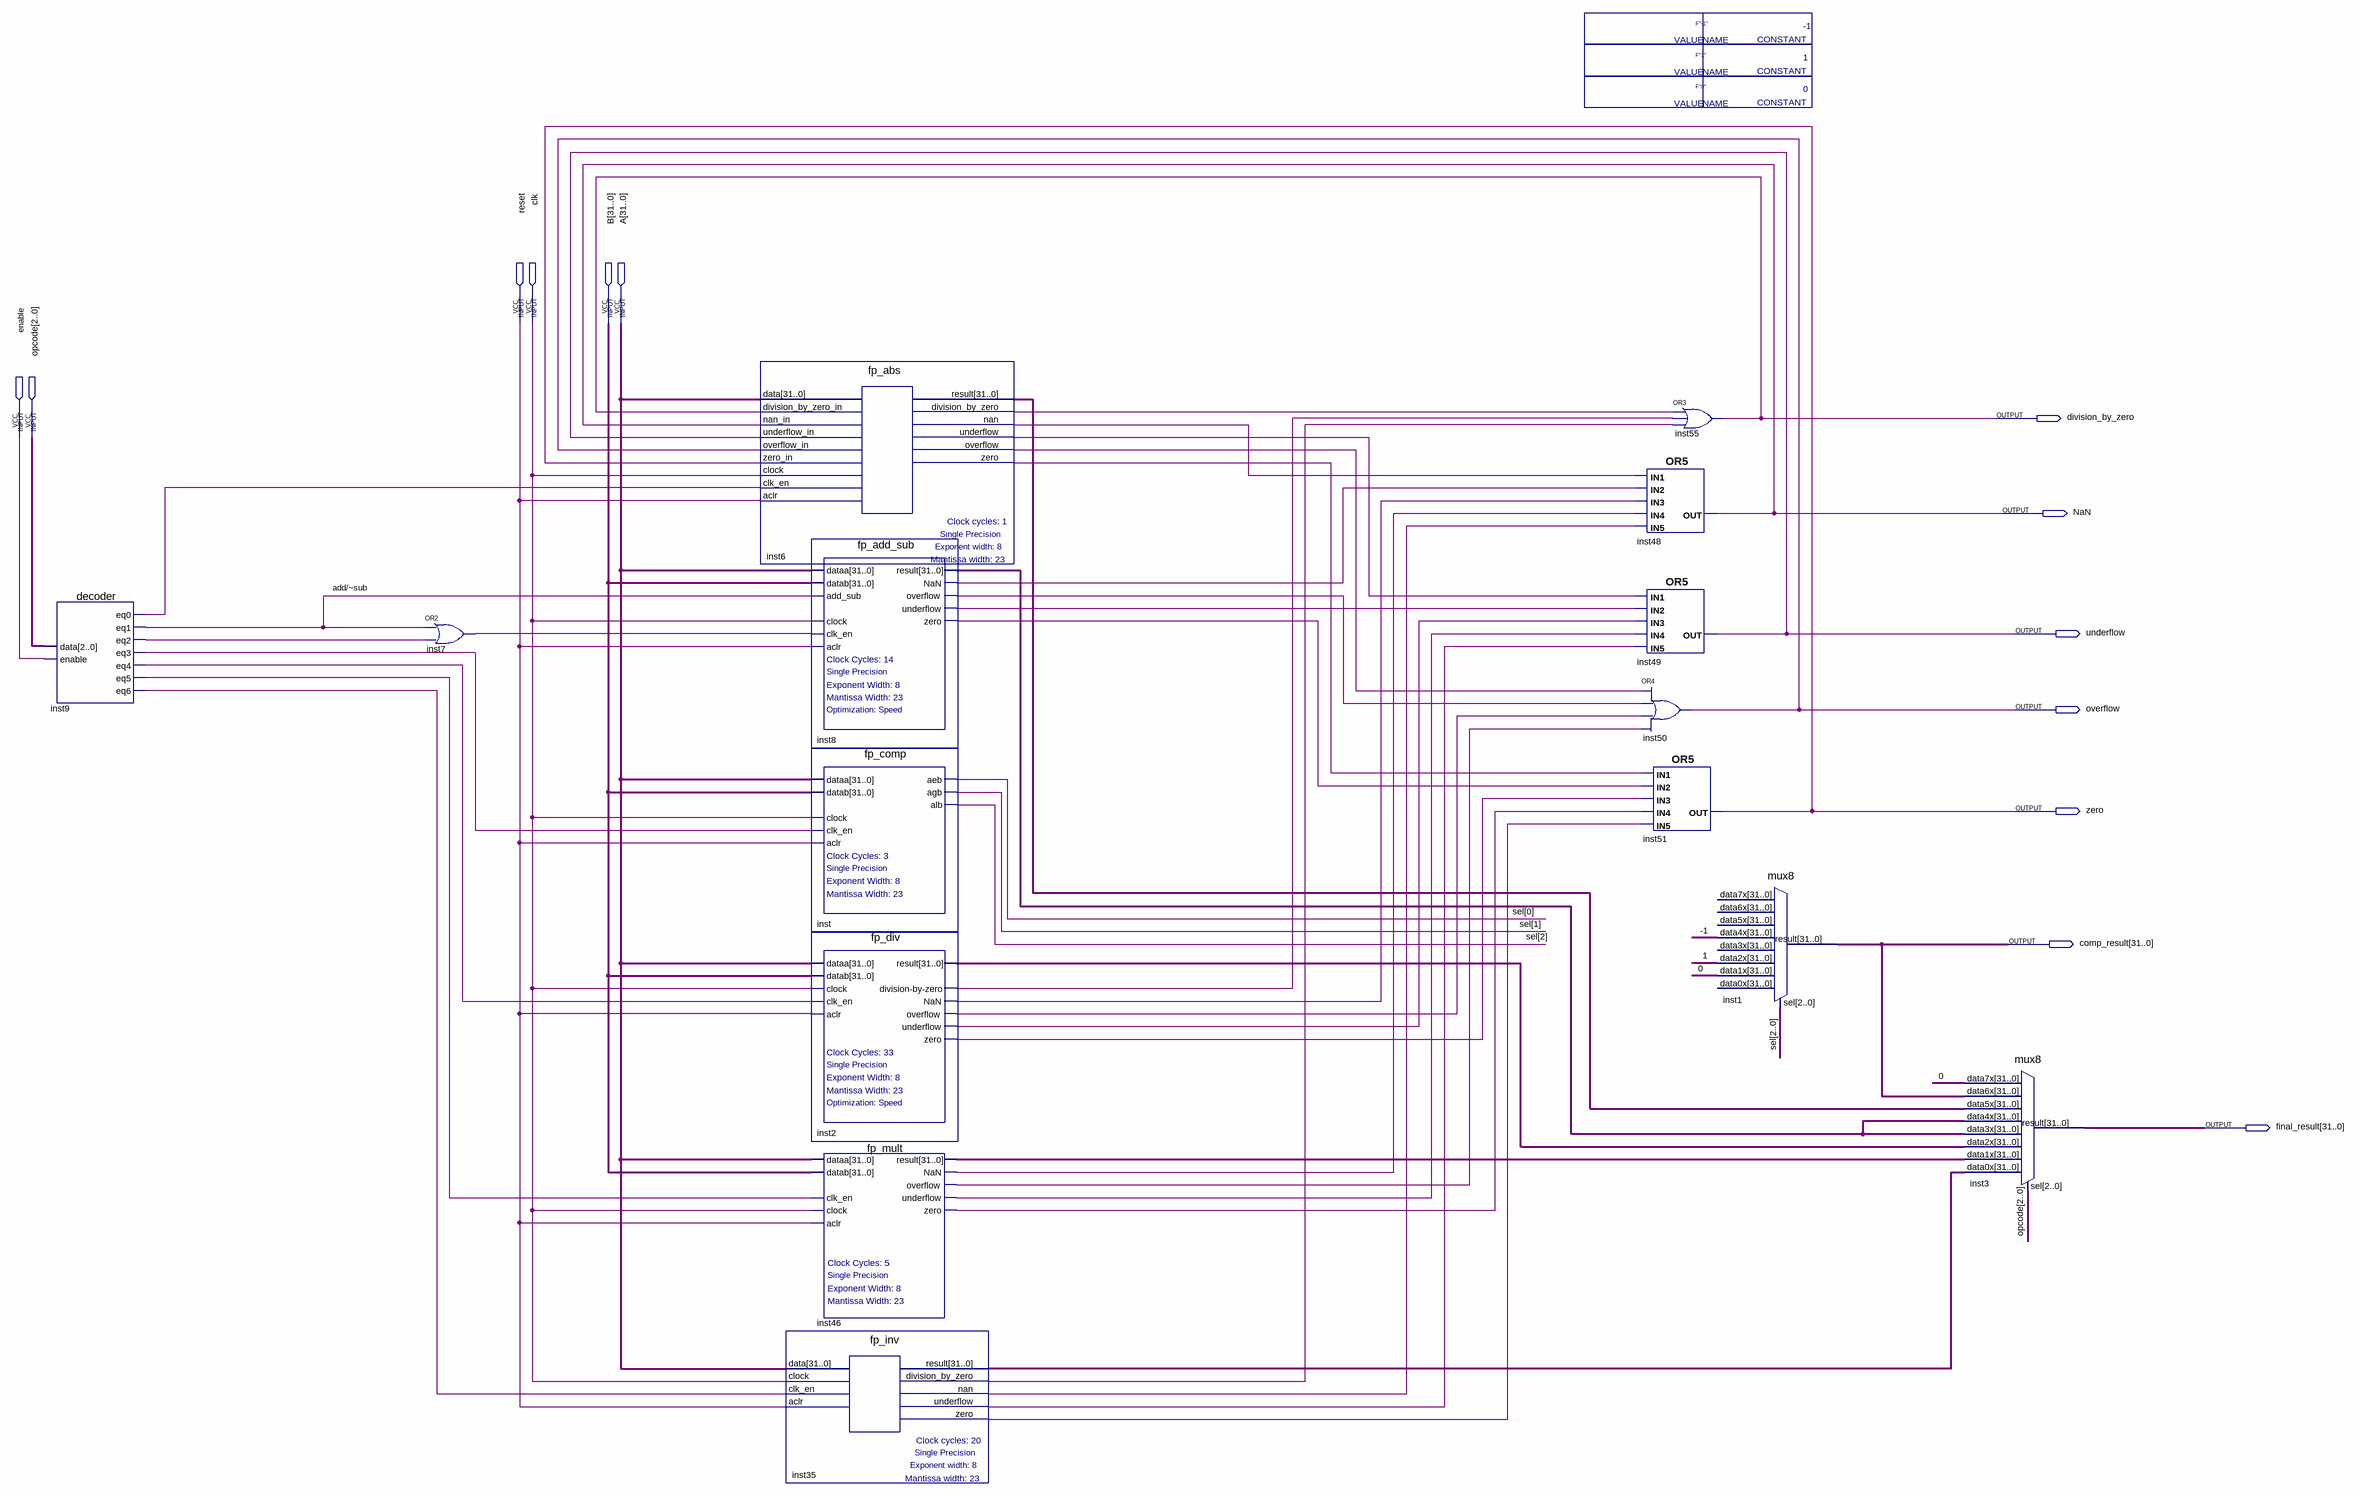
[diagram p0: schematic sheet]
// Quartus schematic fp_alu.bdf as structural Verilog: 15 symbols, 13 pins
module fp_alu #(parameter \1  = "F\"1\"", parameter \0  = "F\"0\"", parameter \-1  = "F\"-1\"") (
  input  reset,
  input  clk,
  input  [31:0] B,
  input  [31:0] A,
  input  enable,
  input  [2:0] opcode,
  output division_by_zero,
  output NaN,
  output underflow,
  output overflow,
  output zero,
  output [31:0] comp_result,
  output [31:0] final_result
);

  wire \0 , \1 , \-1 , \add/~sub , inst2_division_by_zero, inst2_nan, inst2_overflow, inst2_underflow,
       inst2_zero, inst6_division_by_zero, inst6_nan, inst6_overflow, inst6_underflow, inst6_zero, inst7_out,
       inst8_nan, inst8_overflow, inst8_underflow, inst8_zero, inst9_eq0, inst9_eq2, inst9_eq3, inst9_eq4,
       inst9_eq5, inst9_eq6, inst35_division_by_zero, inst35_nan, inst35_underflow, inst35_zero, inst46_nan,
       inst46_overflow, inst46_underflow, inst46_zero;
  wire [2:0] sel;
  wire [31:0] inst2_result, inst6_result, inst8_result, inst35_result, inst46_result;

  decoder inst9 (
    .data(opcode), .enable(enable), .eq0(inst9_eq0), .eq1(\add/~sub ), .eq2(inst9_eq2), .eq3(inst9_eq3),
    .eq4(inst9_eq4), .eq5(inst9_eq5), .eq6(inst9_eq6));
  or inst7 (inst7_out, \add/~sub , inst9_eq2);
  fp_abs inst6 (
    .data(A), .division_by_zero_in(division_by_zero), .nan_in(NaN), .underflow_in(underflow),
    .overflow_in(overflow), .zero_in(zero), .clock(clk), .clk_en(inst9_eq0), .aclr(reset),
    .result(inst6_result), .division_by_zero(inst6_division_by_zero), .nan(inst6_nan),
    .underflow(inst6_underflow), .overflow(inst6_overflow), .zero(inst6_zero));
  fp_inv inst35 (
    .data(A), .clock(clk), .clk_en(inst9_eq6), .aclr(reset), .result(inst35_result),
    .division_by_zero(inst35_division_by_zero), .nan(inst35_nan), .underflow(inst35_underflow),
    .zero(inst35_zero));
  fp_add_sub inst8 (
    .dataa(A), .datab(B), .add_sub(\add/~sub ), .clock(clk), .clk_en(inst7_out), .aclr(reset),
    .result(inst8_result), .NaN(inst8_nan), .overflow(inst8_overflow), .underflow(inst8_underflow),
    .zero(inst8_zero));
  fp_comp inst (
    .dataa(A), .datab(B), .clock(clk), .clk_en(inst9_eq3), .aclr(reset), .aeb(sel[0]), .agb(sel[1]),
    .alb(sel[2]));
  fp_div inst2 (
    .dataa(A), .datab(B), .clock(clk), .clk_en(inst9_eq4), .aclr(reset), .result(inst2_result),
    .\division-by-zero (inst2_division_by_zero), .NaN(inst2_nan), .overflow(inst2_overflow),
    .underflow(inst2_underflow), .zero(inst2_zero));
  fp_mult inst46 (
    .dataa(A), .datab(B), .clk_en(inst9_eq5), .clock(clk), .aclr(reset), .result(inst46_result),
    .NaN(inst46_nan), .overflow(inst46_overflow), .underflow(inst46_underflow), .zero(inst46_zero));
  or inst48 (NaN, inst6_nan, inst8_nan, inst2_nan, inst46_nan, inst35_nan);
  or inst49 (underflow, inst6_underflow, inst8_underflow, inst2_underflow, inst46_underflow, inst35_underflow);
  or inst50 (overflow, inst6_overflow, inst8_overflow, inst2_overflow, inst46_overflow);
  or inst51 (zero, inst6_zero, inst8_zero, inst2_zero, inst46_zero, inst35_zero);
  or inst55 (division_by_zero, inst6_division_by_zero, inst2_division_by_zero, inst35_division_by_zero);
  mux8 inst1 (
    .data4x({32{\-1 }}), .data2x({32{\1 }}), .data1x({32{\0 }}), .sel(sel), .result(comp_result));  // open: data7x, data6x, data5x, data3x, data0x
  mux8 inst3 (
    .data7x({32{\0 }}), .data6x(comp_result), .data5x(inst6_result), .data4x(inst8_result),
    .data3x(inst8_result), .data2x(inst2_result), .data1x(inst46_result), .data0x(inst35_result),
    .sel(opcode), .result(final_result));
endmodule
